# Altium schematic sheet CH374.SchDoc
size A4
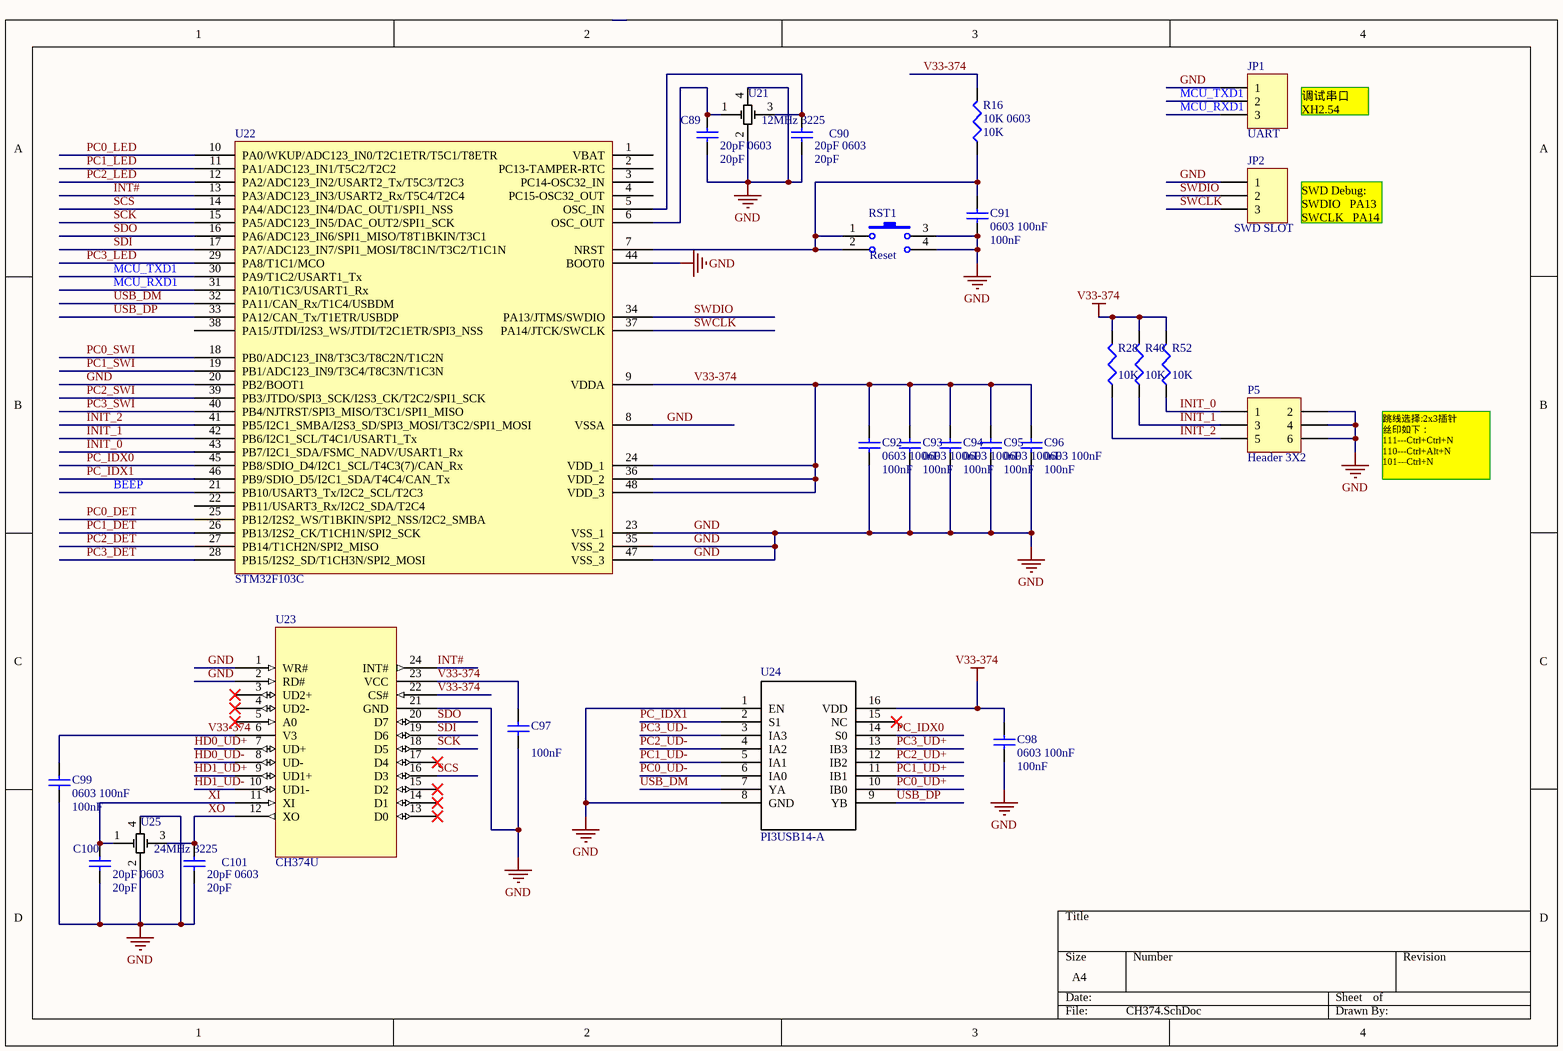
[diagram p0: CH374.SchDoc]

## Parts
C89  20pF 0603  value 20pF  [C0603]
C90  20pF 0603  value 20pF  [C0603]
C91  0603 100nF  value 100nF  [C0603]
C92  0603 100nF  value 100nF  [C0603]
C93  0603 100nF  value 100nF  [C0603]
C94  0603 100nF  value 100nF  [C0603]
C95  0603 100nF  value 100nF  [C0603]
C96  0603 100nF  value 100nF  [C0603]
C97  value 100nF  [C0603]  (hidden comment: 0603 100nF)
C98  0603 100nF  value 100nF  [C0603]
C99  0603 100nF  value 100nF  [C0603]
C100  20pF 0603  value 20pF  [C0603]
C101  20pF 0603  value 20pF  [C0603]
JP1  UART  [XH25-3]
JP2  SWD SLOT  [HDR1X3DIP100A]
P5  Header 3X2  [HDR2X3]
R16  10K 0603  value 10K  [R0603]
R28  value 10K  [R0603]  (hidden comment: 10K 0603)
R40  value 10K  [R0603]  (hidden comment: 10K 0603)
R52  value 10K  [R0603]  (hidden comment: 10K 0603)
RST1  Reset  [key_4SMD7351]
U21  12MHz 3225  [XTAL-3225]
U22  STM32F103C  [QFP48-20-0909B]
U23  CH374U  [SSOP24]
U24  PI3USB14-A  [sop16-26-064a]
U25  24MHz 3225  [XTAL-3225]

## Nets
GND: C89.1 C90.1 C91.1 C92.1 C93.1 C94.1 C95.1 C96.1 C97.1 C98.1 C99.1 C100.1 C101.1 JP1.1 JP2.1 P5.2 P5.4 P5.6 RST1.3 RST1.4 U21.2 U21.4 U22.8(VSSA) U22.20(PB2/BOOT1) U22.23(VSS_1) U22.35(VSS_2) U22.44(BOOT0) U22.47(VSS_3) U23.1(WR#) U23.2(RD#) U23.21(GND) U24.1(EN) U24.8(GND) U25.2 U25.4
V33-374: C92.2 C93.2 C94.2 C95.2 C96.2 C97.2 C98.2 C99.2 R16.2 R28.2 R40.2 R52.2 U22.9(VDDA) U22.24(VDD_1) U22.36(VDD_2) U22.48(VDD_3) U23.6(V3) U23.22(CS#) U23.23(VCC) U24.16(VDD)
BEEP: U22.21(PB10/USART3_Tx/I2C2_SCL/T2C3)
HD0_UD+: U23.7(UD+)
HD0_UD-: U23.8(UD-)
HD1_UD+: U23.9(UD1+)
HD1_UD-: U23.10(UD1-)
INIT_0: P5.1 R52.1 U22.43(PB7/I2C1_SDA/FSMC_NADV/USART1_Rx)
INIT_1: P5.3 R40.1 U22.42(PB6/I2C1_SCL/T4C1/USART1_Tx)
INIT_2: P5.5 R28.1 U22.41(PB5/I2C1_SMBA/I2S3_SD/SPI3_MOSI/T3C2/SPI1_MOSI)
INT#: U22.13(PA3/ADC123_IN3/USART2_Rx/T5C4/T2C4) U23.24(INT#)
MCU_RXD1: JP1.3 U22.31(PA10/T1C3/USART1_Rx)
MCU_TXD1: JP1.2 U22.30(PA9/T1C2/USART1_Tx)
PC0_DET: U22.25(PB12/I2S2_WS/T1BKIN/SPI2_NSS/I2C2_SMBA)
PC0_LED: U22.10(PA0/WKUP/ADC123_IN0/T2C1ETR/T5C1/T8ETR)
PC0_SWI: U22.18(PB0/ADC123_IN8/T3C3/T8C2N/T1C2N)
PC0_UD+: U24.10(IB0)
PC0_UD-: U24.6(IA0)
PC1_DET: U22.26(PB13/I2S2_CK/T1CH1N/SPI2_SCK)
PC1_LED: U22.11(PA1/ADC123_IN1/T5C2/T2C2)
PC1_SWI: U22.19(PB1/ADC123_IN9/T3C4/T8C3N/T1C3N)
PC1_UD+: U24.11(IB1)
PC1_UD-: U24.5(IA1)
PC2_DET: U22.27(PB14/T1CH2N/SPI2_MISO)
PC2_LED: U22.12(PA2/ADC123_IN2/USART2_Tx/T5C3/T2C3)
PC2_SWI: U22.39(PB3/JTDO/SPI3_SCK/I2S3_CK/T2C2/SPI1_SCK)
PC2_UD+: U24.12(IB2)
PC2_UD-: U24.4(IA2)
PC3_DET: U22.28(PB15/I2S2_SD/T1CH3N/SPI2_MOSI)
PC3_LED: U22.29(PA8/T1C1/MCO)
PC3_SWI: U22.40(PB4/NJTRST/SPI3_MISO/T3C1/SPI1_MISO)
PC3_UD+: U24.13(IB3)
PC3_UD-: U24.3(IA3)
PC_IDX0: U22.45(PB8/SDIO_D4/I2C1_SCL/T4C3(7)/CAN_Rx) U24.14(S0)
PC_IDX1: U22.46(PB9/SDIO_D5/I2C1_SDA/T4C4/CAN_Tx) U24.2(S1)
SCK: U22.15(PA5/ADC123_IN5/DAC_OUT2/SPI1_SCK) U23.18(D5)
SCS: U22.14(PA4/ADC123_IN4/DAC_OUT1/SPI1_NSS) U23.16(D3)
SDI: U22.17(PA7/ADC123_IN7/SPI1_MOSI/T8C1N/T3C2/T1C1N) U23.19(D6)
SDO: U22.16(PA6/ADC123_IN6/SPI1_MISO/T8T1BKIN/T3C1) U23.20(D7)
SWCLK: JP2.3 U22.37(PA14/JTCK/SWCLK)
SWDIO: JP2.2 U22.34(PA13/JTMS/SWDIO)
USB_DM: U22.32(PA11/CAN_Rx/T1C4/USBDM) U24.7(YA)
USB_DP: U22.33(PA12/CAN_Tx/T1ETR/USBDP) U24.9(YB)
XI: C100.2 U23.11(XI) U25.1
XO: C101.2 U23.12(XO) U25.3
NetC89_2: C89.2 U21.1 U22.6(OSC_OUT)
NetC90_2: C90.2 U21.3 U22.5(OSC_IN)
NetC91_2: C91.2 R16.1 RST1.1 RST1.2 U22.7(NRST)

Not connected (* = marked no-connect by the designer): U22 1(VBAT) 2(PC13-TAMPER-RTC) 3(PC14-OSC32_IN) 4(PC15-OSC32_OUT) 22(PB11/USART3_Rx/I2C2_SDA/T2C4) 38(PA15/JTDI/I2S3_WS/JTDI/T2C1ETR/SPI3_NSS); U23 3(UD2+)* 4(UD2-)* 5(A0)* 13(D0)* 14(D1)* 15(D2)* 17(D4)*; U24 15(NC)*

## Notes on the sheet
- 调试串口
  XH2.54
- SWD Debug:
  SWDIO   PA13
  SWCLK   PA14
- 跳线选择:2x3插针
  丝印如下：
  111---Ctrl+Ctrl+N
  110---Ctrl+Alt+N
  101---Ctrl+N

## Library data of the parts
C89-C101 = Cap Semi: Capacitor (Semiconductor SIM Model); Published: 8-Jun-2000; LatestRevisionDate: 29-May-2009; LatestRevisionNote: IPC-7351 Footprint Added.; PackageReference: C1206; Publisher: Altium Limited; PackageDescription: Chip Capacitor
JP1 JP2 = Header 3: Header, 3-Pin; LatestRevisionDate: 17-Jul-2002; LatestRevisionNote: Re-released for DXP Platform.; Publisher: Altium Limited
P5 = Header 3X2: Header, 3-Pin, Dual row; LatestRevisionDate: 17-Jul-2002; LatestRevisionNote: Re-released for DXP Platform.; Publisher: Altium Limited
R16 R28 R40 R52 = Res3: Resistor; Published: 8-Jun-2000; LatestRevisionDate: 29-May-2009; LatestRevisionNote: IPC-7351 Footprint Added.; PackageReference: J1-0603; Publisher: Altium Limited; PackageDescription: Chip Resistor
RST1 = key_4smd7337: value: button_4smt
U21 U25 = Component_1
U22 = STM32F103C: STM32单片机48引脚
U24 = PI3USB14-A: Imported; Designer: Chiphome; Device: PI3USB14-A; RefDes: RefDes; Type: DEV; Value: Value